# Altium schematic sheet motor-driver.SchDoc
size A
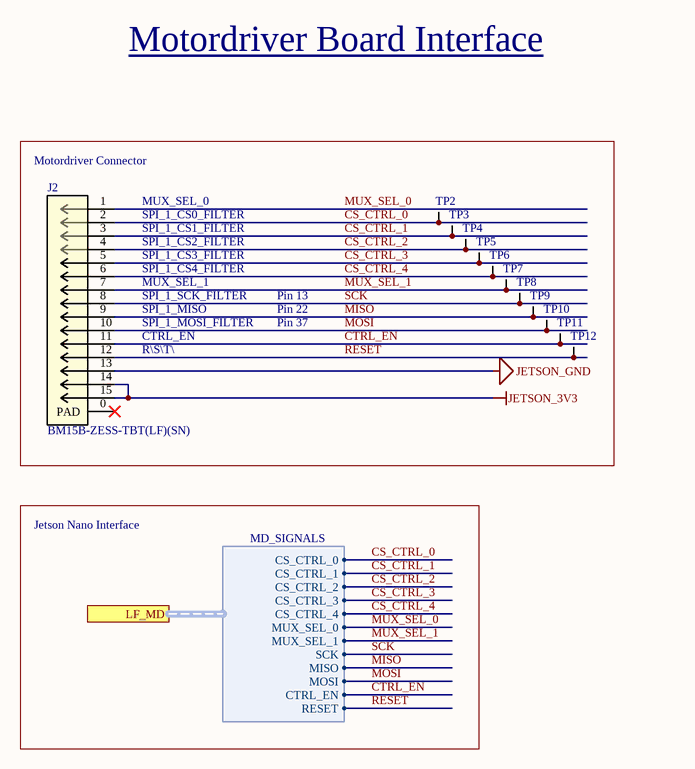
[diagram p0: motor-driver.SchDoc]

## Parts
J2  BM15B-ZESS-TBT(LF)(SN)  [JST ZE SMT 15POS]
TP2  Test Point (Via)  [TP]  (value not drawn)  (no BOM)
TP3  Test Point (Via)  [TP]  (value not drawn)  (no BOM)
TP4  Test Point (Via)  [TP]  (value not drawn)  (no BOM)
TP5  Test Point (Via)  [TP]  (value not drawn)  (no BOM)
TP6  Test Point (Via)  [TP]  (value not drawn)  (no BOM)
TP7  Test Point (Via)  [TP]  (value not drawn)  (no BOM)
TP8  Test Point (Via)  [TP]  (value not drawn)  (no BOM)
TP9  Test Point (Via)  [TP]  (value not drawn)  (no BOM)
TP10  Test Point (Via)  [TP]  (value not drawn)  (no BOM)
TP11  Test Point (Via)  [TP]  (value not drawn)  (no BOM)
TP12  Test Point (Via)  [TP]  (value not drawn)  (no BOM)

## Ports
LF_MD (harness MD_SIGNALS)

## Harnesses
MD_SIGNALS: CS_CTRL_0, MUX_SEL_1, SCK, MOSI, MISO, CS_CTRL_1, CS_CTRL_2, CS_CTRL_3, CS_CTRL_4, MUX_SEL_0, CTRL_EN, RESET

## Nets
JETSON_3V3: J2.14 J2.15
JETSON_GND: J2.13
CS_CTRL_0: J2.2 TP2.1 ; port LF_MD.CS_CTRL_0
CS_CTRL_1: J2.3 TP3.1 ; port LF_MD.CS_CTRL_1
CS_CTRL_2: J2.4 TP4.1 ; port LF_MD.CS_CTRL_2
CS_CTRL_3: J2.5 TP5.1 ; port LF_MD.CS_CTRL_3
CS_CTRL_4: J2.6 TP6.1 ; port LF_MD.CS_CTRL_4
CTRL_EN: J2.11 TP11.1 ; port LF_MD.CTRL_EN
MISO: J2.9 TP9.1 ; port LF_MD.MISO
MOSI: J2.10 TP10.1 ; port LF_MD.MOSI
MUX_SEL_0: J2.1 ; port LF_MD.MUX_SEL_0
MUX_SEL_1: J2.7 TP7.1 ; port LF_MD.MUX_SEL_1
RESET: J2.12 TP12.1 ; port LF_MD.RESET
SCK: J2.8 TP8.1 ; port LF_MD.SCK

Not connected (* = marked no-connect by the designer): J2 0(PAD)*

## Notes on the sheet
- Motordriver Board Interface
- (near J2) Motordriver Connector
- MUX_SEL_0
- SPI_1_CS0_FILTER
- SPI_1_CS1_FILTER
- SPI_1_CS2_FILTER
- SPI_1_CS3_FILTER
- SPI_1_CS4_FILTER
- CTRL_EN
- SPI_1_SCK_FILTER
- SPI_1_MISO
- SPI_1_MOSI_FILTER
- MUX_SEL_1
- Pin 37
- Pin 22
- Pin 13
- R\S\T\
- Jetson Nano Interface

## Library data of the parts
J2 = CN 15POS JST ZE SMT: CONN HEADER VERT SMD 15POS ZE; Supplier 1: Digi-Key; Supplier Part Number 1: 455-4211-1-ND; Part Number: CN 15POS JST ZE SMT; Manufacturer Part Number 1: BM15B-ZESS-TBT(LF)(SN); Supplier URL 1: https://www.digikey.ca/en/products/detail/jst-sales-america-inc/BM15B-ZESS-TBT-LF-SN/1886999?s=N4IgTCBcDaIEIFkCMBWOBaAWgUQMq-QBU5CAKAGQDEBKU3AOWpAF0BfIA; Pin Count: 15
TP2-TP12 = Test Point (Via): Part Number: Test Point (Via)